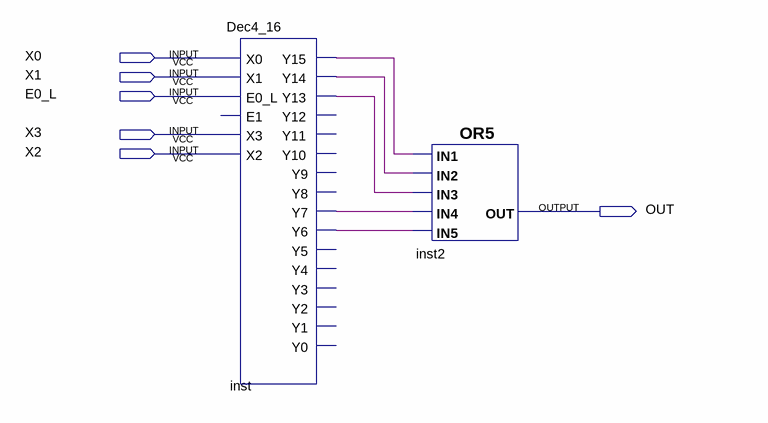
[diagram p0: schematic sheet]
// Quartus schematic DecoderDemo3.bdf as structural Verilog: 2 symbols, 6 pins
module DecoderDemo3 (
  input  X0,
  input  X1,
  input  E0_L,
  input  X3,
  input  X2,
  output OUT
);

  wire inst_y6, inst_y7, inst_y13, inst_y14, inst_y15;

  Dec4_16 inst (
    .X0(X0), .X1(X1), .E0_L(E0_L), .X3(X3), .X2(X2), .Y15(inst_y15), .Y14(inst_y14), .Y13(inst_y13),
    .Y7(inst_y7), .Y6(inst_y6));  // open: E1, Y12, Y11, Y10, Y9, Y8, Y5, Y4, Y3, Y2, Y1, Y0
  or inst2 (OUT, inst_y15, inst_y14, inst_y13, inst_y7, inst_y6);
endmodule
